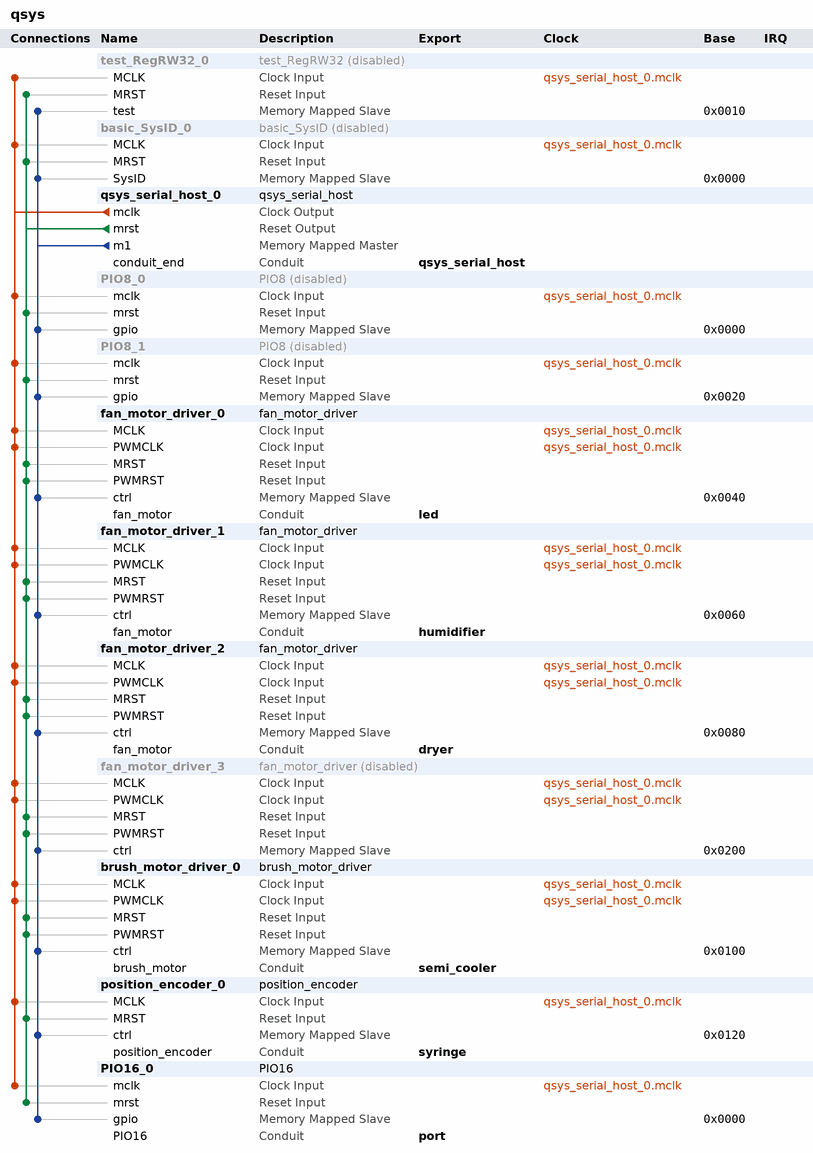
[diagram p0: system contents]
# Platform Designer (Qsys) system qsys, MAX II EPM1270T144C5
# Parameters at their usual value, and those the tool derives, are not listed.
package require qsys
create_system qsys
set_project_property DEVICE_FAMILY {MAX II}
set_project_property DEVICE EPM1270T144C5

add_instance test_RegRW32_0 test_RegRW32 1.0
set_instance_property test_RegRW32_0 ENABLED false

add_instance basic_SysID_0 basic_SysID 1.0
set_instance_property basic_SysID_0 ENABLED false

add_instance qsys_serial_host_0 qsys_serial_host 1.0
set_instance_parameter_value qsys_serial_host_0 initial_state 0

add_instance PIO8_0 PIO8 1.0
set_instance_property PIO8_0 ENABLED false

add_instance PIO8_1 PIO8 1.0
set_instance_property PIO8_1 ENABLED false

add_instance fan_motor_driver_0 fan_motor_driver 1.0

add_instance fan_motor_driver_1 fan_motor_driver 1.0

add_instance fan_motor_driver_2 fan_motor_driver 1.0

add_instance fan_motor_driver_3 fan_motor_driver 1.0
set_instance_property fan_motor_driver_3 ENABLED false

add_instance brush_motor_driver_0 brush_motor_driver 1.0

add_instance position_encoder_0 position_encoder 1.0

add_instance PIO16_0 PIO16 1.0

# connections
add_connection qsys_serial_host_0.mclk basic_SysID_0.MCLK clock
add_connection qsys_serial_host_0.mclk brush_motor_driver_0.MCLK clock
add_connection qsys_serial_host_0.mclk brush_motor_driver_0.PWMCLK clock
add_connection qsys_serial_host_0.mclk fan_motor_driver_0.MCLK clock
add_connection qsys_serial_host_0.mclk fan_motor_driver_0.PWMCLK clock
add_connection qsys_serial_host_0.mclk fan_motor_driver_1.MCLK clock
add_connection qsys_serial_host_0.mclk fan_motor_driver_1.PWMCLK clock
add_connection qsys_serial_host_0.mclk fan_motor_driver_2.MCLK clock
add_connection qsys_serial_host_0.mclk fan_motor_driver_2.PWMCLK clock
add_connection qsys_serial_host_0.mclk fan_motor_driver_3.MCLK clock
add_connection qsys_serial_host_0.mclk fan_motor_driver_3.PWMCLK clock
add_connection qsys_serial_host_0.mclk PIO8_0.mclk clock
add_connection qsys_serial_host_0.mclk PIO8_1.mclk clock
add_connection qsys_serial_host_0.mclk PIO16_0.mclk clock
add_connection qsys_serial_host_0.mclk position_encoder_0.MCLK clock
add_connection qsys_serial_host_0.mclk test_RegRW32_0.MCLK clock
add_connection qsys_serial_host_0.mrst basic_SysID_0.MRST reset
add_connection qsys_serial_host_0.mrst brush_motor_driver_0.MRST reset
add_connection qsys_serial_host_0.mrst brush_motor_driver_0.PWMRST reset
add_connection qsys_serial_host_0.mrst fan_motor_driver_0.MRST reset
add_connection qsys_serial_host_0.mrst fan_motor_driver_0.PWMRST reset
add_connection qsys_serial_host_0.mrst fan_motor_driver_1.MRST reset
add_connection qsys_serial_host_0.mrst fan_motor_driver_1.PWMRST reset
add_connection qsys_serial_host_0.mrst fan_motor_driver_2.MRST reset
add_connection qsys_serial_host_0.mrst fan_motor_driver_2.PWMRST reset
add_connection qsys_serial_host_0.mrst fan_motor_driver_3.MRST reset
add_connection qsys_serial_host_0.mrst fan_motor_driver_3.PWMRST reset
add_connection qsys_serial_host_0.mrst PIO8_0.mrst reset
add_connection qsys_serial_host_0.mrst PIO8_1.mrst reset
add_connection qsys_serial_host_0.mrst PIO16_0.mrst reset
add_connection qsys_serial_host_0.mrst position_encoder_0.MRST reset
add_connection qsys_serial_host_0.mrst test_RegRW32_0.MRST reset
add_connection qsys_serial_host_0.m1 basic_SysID_0.SysID avalon
set_connection_parameter_value qsys_serial_host_0.m1/basic_SysID_0.SysID baseAddress 0x0000
add_connection qsys_serial_host_0.m1 brush_motor_driver_0.ctrl avalon
set_connection_parameter_value qsys_serial_host_0.m1/brush_motor_driver_0.ctrl baseAddress 0x0100
add_connection qsys_serial_host_0.m1 fan_motor_driver_0.ctrl avalon
set_connection_parameter_value qsys_serial_host_0.m1/fan_motor_driver_0.ctrl baseAddress 0x0040
add_connection qsys_serial_host_0.m1 fan_motor_driver_1.ctrl avalon
set_connection_parameter_value qsys_serial_host_0.m1/fan_motor_driver_1.ctrl baseAddress 0x0060
add_connection qsys_serial_host_0.m1 fan_motor_driver_2.ctrl avalon
set_connection_parameter_value qsys_serial_host_0.m1/fan_motor_driver_2.ctrl baseAddress 0x0080
add_connection qsys_serial_host_0.m1 fan_motor_driver_3.ctrl avalon
set_connection_parameter_value qsys_serial_host_0.m1/fan_motor_driver_3.ctrl baseAddress 0x0200
add_connection qsys_serial_host_0.m1 PIO8_0.gpio avalon
set_connection_parameter_value qsys_serial_host_0.m1/PIO8_0.gpio baseAddress 0x0000
add_connection qsys_serial_host_0.m1 PIO8_1.gpio avalon
set_connection_parameter_value qsys_serial_host_0.m1/PIO8_1.gpio baseAddress 0x0020
add_connection qsys_serial_host_0.m1 PIO16_0.gpio avalon
set_connection_parameter_value qsys_serial_host_0.m1/PIO16_0.gpio baseAddress 0x0000
add_connection qsys_serial_host_0.m1 position_encoder_0.ctrl avalon
set_connection_parameter_value qsys_serial_host_0.m1/position_encoder_0.ctrl baseAddress 0x0120
add_connection qsys_serial_host_0.m1 test_RegRW32_0.test avalon
set_connection_parameter_value qsys_serial_host_0.m1/test_RegRW32_0.test baseAddress 0x0010

# exported interfaces
add_interface qsys_serial_host conduit end
set_interface_property qsys_serial_host EXPORT_OF qsys_serial_host_0.conduit_end
add_interface led conduit end
set_interface_property led EXPORT_OF fan_motor_driver_0.fan_motor
add_interface humidifier conduit end
set_interface_property humidifier EXPORT_OF fan_motor_driver_1.fan_motor
add_interface semi_cooler conduit end
set_interface_property semi_cooler EXPORT_OF brush_motor_driver_0.brush_motor
add_interface dryer conduit end
set_interface_property dryer EXPORT_OF fan_motor_driver_2.fan_motor
add_interface syringe conduit end
set_interface_property syringe EXPORT_OF position_encoder_0.position_encoder
add_interface port conduit end
set_interface_property port EXPORT_OF PIO16_0.PIO16

save_system qsys.qsys
